# Altium schematic sheet 5V_circuit.SchDoc
size A
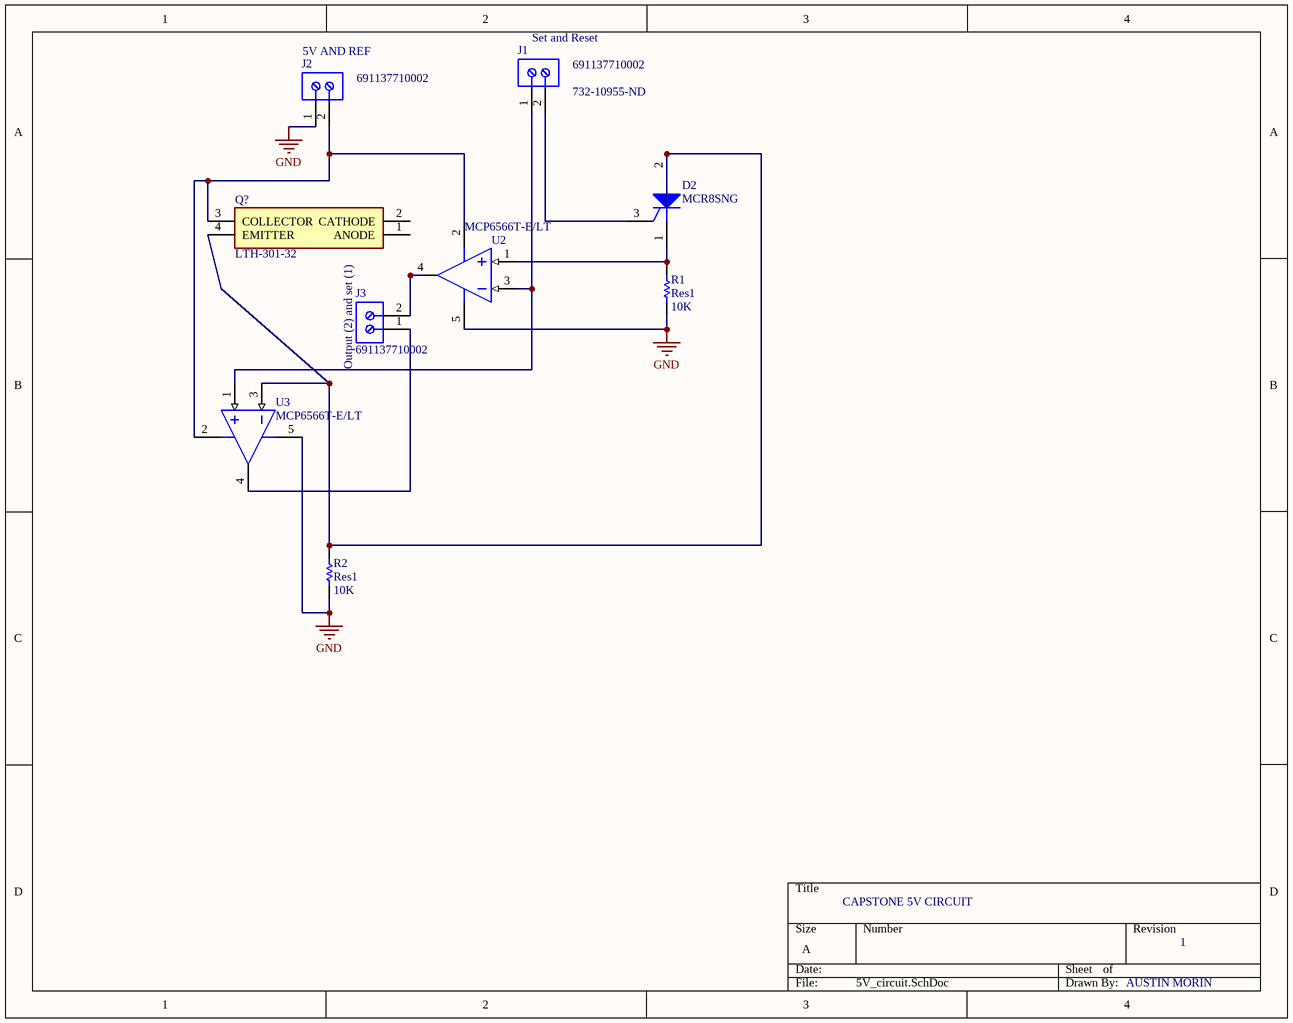
[diagram p0: 5V_circuit.SchDoc]

## Parts
D2  MCR8SNG  [ONSC-TO-220-3-221A-09_AF]
J1  691137710002  Supplier Part Number 1: 732-10955-ND  [691137710002]
J2  691137710002  [691137710002]
J3  691137710002  [691137710002]
Q?  LTH-301-32  [LTH30132]
R1  Res1  value 10K  [AXIAL-0.3]
R2  Res1  value 10K  [AXIAL-0.3]
U2  MCP6566T-E/LT  [SC70-LT5_N]
U3  MCP6566T-E/LT  [SC70-LT5_N]

## Nets
GND: J2.1 R1.1 R2.1 U2.5(VDD) U3.5(VDD)
NetD2_1: D2.1(K) R1.2 U2.1(VIN+)
NetD2_2: D2.2(A) Q?.4(EMITTER) R2.2 U3.3(VIN-)
NetD2_3: D2.3(G) J1.2
NetJ1_1: J1.1 U2.3(VIN-) U3.1(VIN+)
NetJ2_2: J2.2 Q?.3(COLLECTOR) U2.2(VSS) U3.2(VSS)
NetJ3_1: J3.1 U3.4(OUT)
NetJ3_2: J3.2 U2.4(OUT)

Not connected (* = marked no-connect by the designer): Q? 1(ANODE) 2(CATHODE)

## Notes on the sheet
- (near J2) 5V AND REF
- (near J1) Set and Reset
- (near Q?) Output (2) and set (1)
- CAPSTONE 5V CIRCUIT
- 1
- AUSTIN MORIN

## Library data of the parts
D2 = CMP-1068-00111-1: Sensitive Gate Silicon Controlled Rectifier, Reverse Blocking Thyristor, 0.2 mA, 3-Pin TO-220, Pb-Free, Tube; Manufacturer: On Semiconductor; IT(RMS) Max (A): 8; IGT Max (mA): 0.2; ITSM Max (A): 80; ComponentLink1Description: Manufacturer URL; ComponentLink2URL: http://www.onsemi.cn/pub_link/Collateral/MCR8S-D.PDF; ComponentLink2Description: Datasheet; RoHS: Pb-Free; ComponentLink1URL: http://www.onsemi.com/; PackageDescription: 3-Pin Flange Mount, Vertical Straight Lead, Body 9.97 x 4.445 mm, Pitch 2.54 mm; PackageReference: TO-220-3-221A-09_AF; Mounting Technology: Through Hole; ComponentLink3URL: http://www.onsemi.cn/pub_link/Collateral/MCR8S-D.PDF; PackageVersion: Rev. AF; Packing: Tube; ComponentLink3Description: Package Specification; PartNumber: MCR8SNG; DatasheetVersion: Rev. 4
J1-J3 = CMP-1502-03324-2: NexarPartId: 78871135; Voltage Rating: 300V; Number of Contacts: 2; Current Rating: 16A; Lead Pitch: 5mm; Height: 11.6mm; Packaging: Box; RoHS: Non-Compliant; Contact Material: Nickel, Tin; Max Operating Temperature: 120°C; Number of Pins: 2; Min Operating Temperature: -30°C; Number of Rows: 1
  J1: Supplier 1: Digi-Key
Q? = LTH-301-32: Phototransistor; Manufacturer_Name: Lite-On; Datasheet Link: http://optoelectronics.liteon.com/upload/download/DS-55-96-0005/LTH-301-32DS.pdf; Height: 16mm; Manufacturer_Part_Number: LTH-301-32; Mouser Part Number: 859-LTH-301-32; Mouser Price/Stock: https://www.mouser.co.uk/ProductDetail/Lite-On/LTH-301-32?qs=WxFF5lh7QM2oOLU3SLNnMA%3D%3D; Arrow Part Number: LTH-301-32; Arrow Price/Stock: https://www.arrow.com/en/products/lth-301-32/lite-on-technology?region=nac
R1 R2 = Res1: Resistor; Published: 8-Jun-2000; LatestRevisionDate: 17-Jul-2002; LatestRevisionNote: Re-released for DXP Platform.; PackageReference: AXIAL-0.3; Publisher: Altium Limited; PackageDescription: Axial Device, Thru-Hole; 2 Leads; 0.3 in Pin Spacing
U2 U3 = CMP-0187-00418-3: None; Input Offset Voltage (Vos): 10mV; Power Supply Rejection Ratio (PSRR): 70dB; Max Supply Voltage: 5.5V; Output Current: 50mA; Nominal Supply Current: 130uA; Output Current per Channel: 30mA; Input Bias Current: 1pA; Output Compatibility: CMOS; Hysteresis: 5mV; Propagation Delay: 80ns; Turn-On Delay Time: 56ns; Number of Amplifiers: 1; Common Mode Rejection Ratio: 66dB; Min Supply Voltage: 1.8V; Response Time: 49ns; Operating Supply Voltage: 5V; Min Operating Temperature: -40°C; Max Operating Temperature: 125°C; Type: General Purpose; Max Supply Current: 130uA; Supply Current: 130uA; Width: 1.25mm; Case/Package: SC; Termination: SMD/SMT; REACH SVHC: No SVHC; Quiescent Current: 130uA; Mount: Surface Mount; Length: 2mm; Height: 1mm; Number of Elements: 1; RoHS Compliant: Yes; Max Input Current: 1pA; Number of Pins: 5; Packaging: Tape and Reel; Package Quantity: 3000; Radiation Hardening: No; Technology: CMOS; Number of Channels: 1; Lead Free: Lead Free